# Altium schematic sheet leak_sensor.SchDoc
size A4
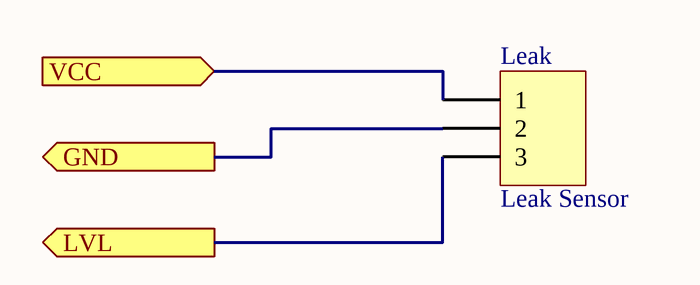
[diagram p0: leak_sensor.SchDoc]

## Parts
Leak  Leak Sensor  [3_channel_terminal_block]

## Ports
GND (out), LVL (out), VCC (in)

## Nets
GND: Leak.2 ; port GND
LVL: Leak.3 ; port LVL
VCC: Leak.1 ; port VCC

## Library data of the parts
Leak = Header 3: Header, 3-Pin; LatestRevisionDate: 17-Jul-2002; LatestRevisionNote: Re-released for DXP Platform.; Publisher: Altium Limited